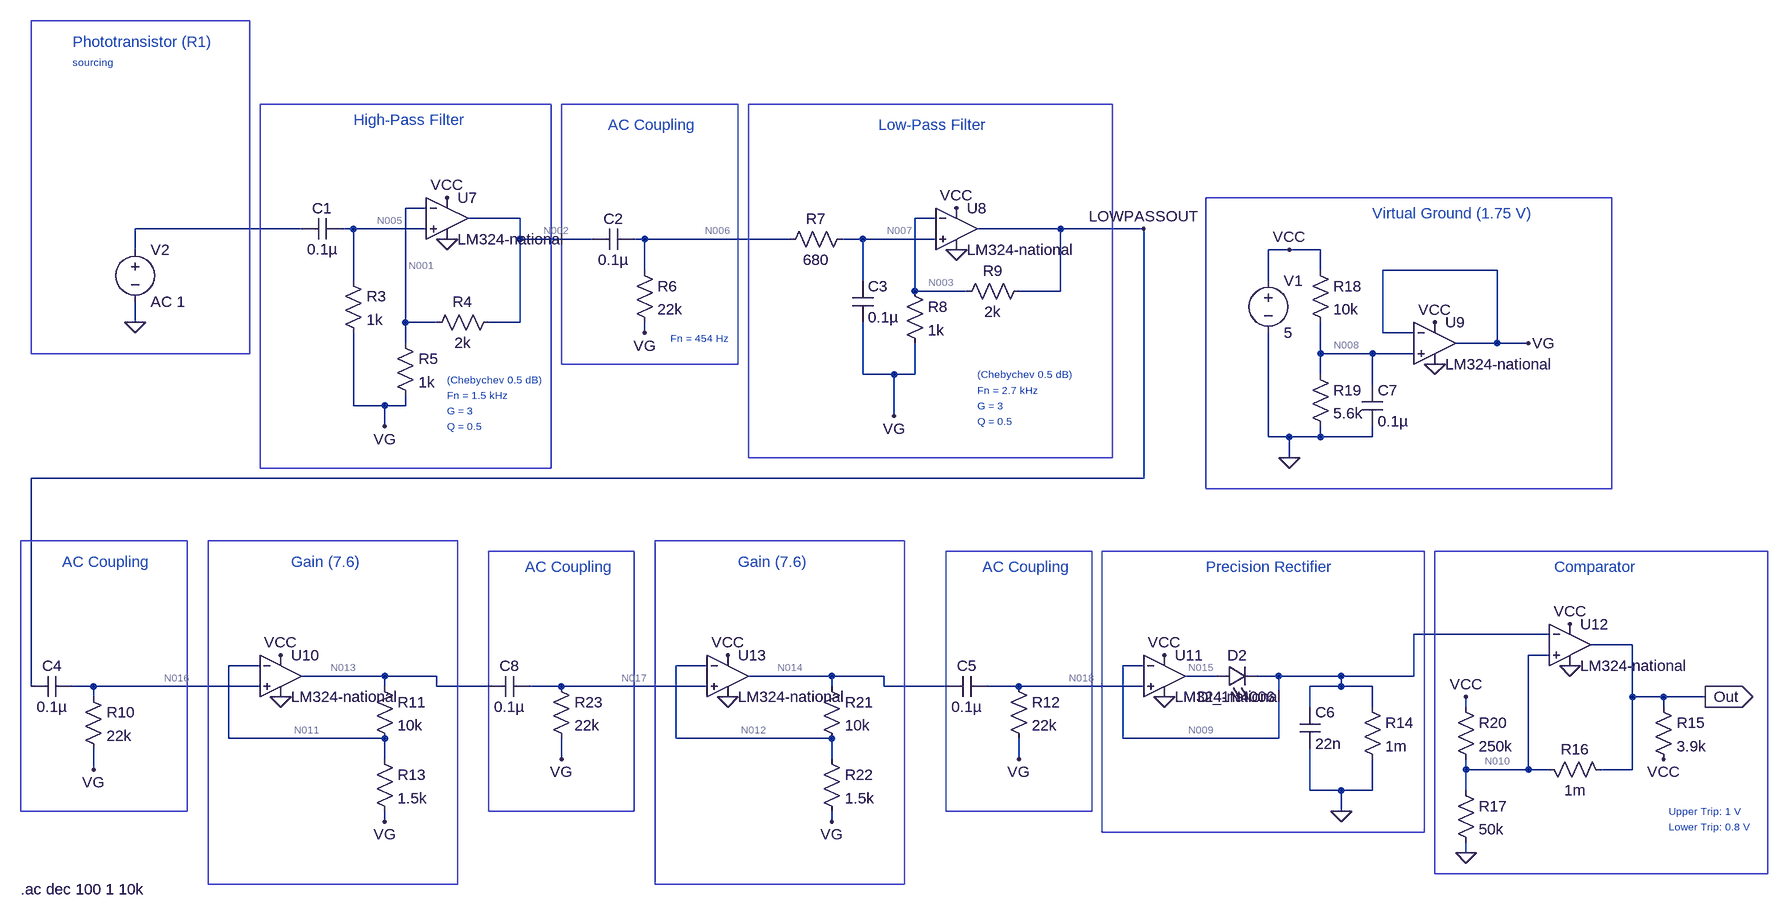
[diagram p0: schematic infrared_sensor_ac.asc]
* infrared_sensor_ac.asc
C1 N005 N004 0.1µ
R3 N005 VG 1k
R4 N002 N001 2k
R5 N001 VG 1k
C2 N006 N002 0.1µ
R6 N006 VG 22k
R7 N007 N006 680
C3 N007 VG 0.1µ
R8 N003 VG 1k
R9 LOWPASSOUT N003 2k
C4 LOWPASSOUT N016 0.1µ
R10 N016 VG 22k
R11 N013 N011 10k
C5 N014 N018 0.1µ
R12 N018 VG 22k
R13 N011 VG 1.5k
D2 N015 N009 DI_1N4006
C6 N009 0 22n
R14 N009 0 1m
R15 Out VCC 3.9k
R16 N010 Out 1m
R17 N010 0 50k
V1 VCC 0 5
R18 VCC N008 10k
R19 N008 0 5.6k
R20 VCC N010 250k
C7 N008 0 0.1µ
* U7: LM324-national (symbol LM324-national not available, pins judged from their places): In+=N005 In-=N001 V+=VCC V-=0 OUT=N002
* U8: LM324-national (symbol LM324-national not available, pins judged from their places): In+=N007 In-=N003 V+=VCC V-=0 OUT=LOWPASSOUT
* U9: LM324-national (symbol LM324-national not available, pins judged from their places): In+=N008 In-=VG V+=VCC V-=0 OUT=VG
* U10: LM324-national (symbol LM324-national not available, pins judged from their places): In+=N016 In-=N011 V+=VCC V-=0 OUT=N013
* U11: LM324-national (symbol LM324-national not available, pins judged from their places): In+=N018 In-=N009 V+=VCC V-=0 OUT=N015
* U12: LM324-national (symbol LM324-national not available, pins judged from their places): In+=N010 In-=N009 V+=VCC V-=0 OUT=Out
R21 N014 N012 10k
R22 N012 VG 1.5k
* U13: LM324-national (symbol LM324-national not available, pins judged from their places): In+=N017 In-=N012 V+=VCC V-=0 OUT=N014
C8 N013 N017 0.1µ
R23 N017 VG 22k
V2 N004 0 AC 1
.model D D
.lib standard.dio
* Gain (7.6)
* Precision Rectifier
* AC Coupling
* AC Coupling
* AC Coupling
* Low-Pass Filter
* (Chebychev 0.5 dB)
* Fn = 2.7 kHz
* G = 3
* Q = 0.5
* Fn = 454 Hz
* High-Pass Filter
* Fn = 1.5 kHz
* (Chebychev 0.5 dB)
* G = 3
* Q = 0.5
* Virtual Ground (1.75 V)
* Comparator
* Lower Trip: 0.8 V
* Upper Trip: 1 V
* Phototransistor (R1)
* sourcing
.ac dec 100 1 10k
* Gain (7.6)
* AC Coupling
.backanno
.end

* Results of the author's LTspice run, read from the files saved beside the schematic
* Operating Point, zero values left out:
*   V(n005) = 1.797 V
*   V(vg) = 1.797 V
*   V(n002) = 1.803 V
*   V(n001) = 1.799 V
*   V(n006) = 1.798 V
*   V(n007) = 1.798 V
*   V(n003) = 1.8 V
*   V(lowpassout) = 1.806 V
*   V(n016) = 1.798 V
*   V(n013) = 1.82 V
*   V(n011) = 1.8 V
*   V(n014) = 1.82 V
*   V(n018) = 1.758 V
*   V(n015) = 751.6 mV
*   V(n009) = 37.2 µV
*   V(out) = 4.066 V
*   V(vcc) = 5 V
*   V(n010) = 4.066 V
*   V(n008) = 1.795 V
*   V(n012) = 1.8 V
*   V(n017) = 1.798 V
*   I(D2) = 37.2 mA
*   I(R23) = 51.94 nA
*   I(R22) = 2.073 µA
*   I(R21) = 2.035 µA
*   I(R20) = 3.737 µA
*   I(R19) = 320.5 µA
*   I(R18) = 320.5 µA
*   I(R17) = 81.32 µA
*   I(R16) = -81.64 µA
*   I(R15) = -239.5 µA
*   I(R14) = 37.2 mA
*   I(R13) = 2.073 µA
*   I(R12) = -1.753 µA
*   I(R11) = 2.035 µA
*   I(R10) = 51.94 nA
*   I(R9) = 3.107 µA
*   I(R8) = 3.145 µA
*   I(R7) = 51.94 nA
*   I(R6) = 51.94 nA
*   I(R5) = 2.019 µA
*   I(R4) = 1.981 µA
*   I(R3) = 51.94 nA
*   I(V1) = -37.37 mA
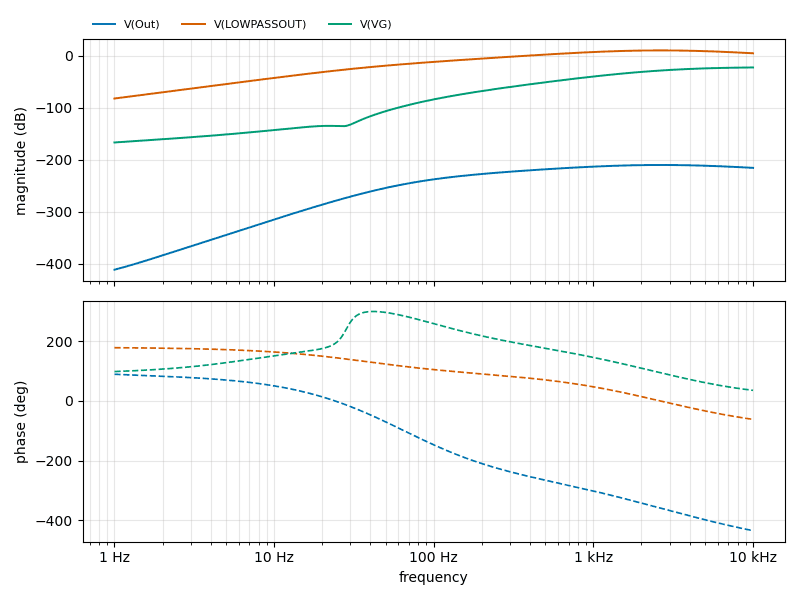
[diagram p1: AC Analysis of infrared_sensor_ac.asc, plotted from the saved traces]
* AC Analysis, 1 run:
*   V(Out): -411.82 dB at 1 Hz, -215.70 dB at 10 kHz, peak -210.15 dB at 2.63 kHz, 3 dB below the peak at 1.028 kHz and 6.816 kHz
*   V(LOWPASSOUT): -82.14 dB at 1 Hz, 4.96 dB at 10 kHz, peak 10.51 dB at 2.63 kHz, 3 dB below the peak at 1.019 kHz and 6.813 kHz
*   V(VG): -166.81 dB at 1 Hz, -22.34 dB at 10 kHz, peak -22.34 dB at 10 kHz, 3 dB below the peak at 3.899 kHz